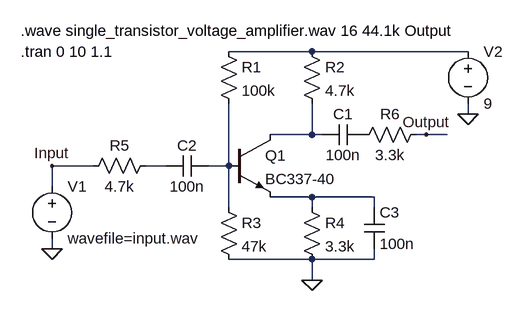
[diagram p0: schematic single_transistor_voltage_amplifier.asc]
single_transistor_voltage_amplifier.asc, the LTspice schematic file:
Version 4
SHEET 1 880 680
WIRE 224 -1696 96 -1696
WIRE 464 -1696 224 -1696
WIRE 464 -1600 464 -1616
WIRE 224 -1568 224 -1616
WIRE 224 -1568 160 -1568
WIRE 240 -1568 224 -1568
WIRE 400 -1568 384 -1568
WIRE 432 -1568 400 -1568
WIRE -112 -1520 -176 -1520
WIRE 0 -1520 -32 -1520
WIRE 96 -1520 96 -1616
WIRE 96 -1520 64 -1520
WIRE -176 -1488 -176 -1520
WIRE 224 -1472 160 -1472
WIRE 320 -1472 224 -1472
WIRE 96 -1456 96 -1520
WIRE 224 -1456 224 -1472
WIRE 320 -1456 320 -1472
WIRE -176 -1392 -176 -1408
WIRE 224 -1376 96 -1376
WIRE 320 -1376 320 -1392
WIRE 320 -1376 224 -1376
WIRE 224 -1344 224 -1376
FLAG -176 -1392 0
FLAG 224 -1344 0
FLAG 464 -1600 0
FLAG -176 -1520 Input
FLAG 400 -1568 Output
SYMBOL npn 96 -1568 R0
SYMATTR InstName Q1
SYMATTR Value BC337-40
SYMBOL res 80 -1712 R0
SYMATTR InstName R1
SYMATTR Value 100k
SYMBOL res 208 -1712 R0
SYMATTR InstName R2
SYMATTR Value 4.7k
SYMBOL res 80 -1472 R0
SYMATTR InstName R3
SYMATTR Value 47k
SYMBOL res 208 -1472 R0
SYMATTR InstName R4
SYMATTR Value 3.3k
SYMBOL res -16 -1536 R90
WINDOW 0 0 56 VBottom 2
WINDOW 3 32 56 VTop 2
SYMATTR InstName R5
SYMATTR Value 4.7k
SYMBOL res 400 -1584 R90
WINDOW 0 0 56 VBottom 2
WINDOW 3 32 56 VTop 2
SYMATTR InstName R6
SYMATTR Value 3.3k
SYMBOL cap 304 -1584 R90
WINDOW 0 0 32 VBottom 2
WINDOW 3 32 32 VTop 2
SYMATTR InstName C1
SYMATTR Value 100n
SYMBOL cap 64 -1536 R90
WINDOW 0 0 32 VBottom 2
WINDOW 3 32 32 VTop 2
SYMATTR InstName C2
SYMATTR Value 100n
SYMBOL cap 304 -1456 R0
SYMATTR InstName C3
SYMATTR Value 100n
SYMBOL voltage 464 -1712 R0
WINDOW 123 0 0 Left 0
WINDOW 39 0 0 Left 0
SYMATTR InstName V2
SYMATTR Value 9
SYMBOL voltage -176 -1504 R0
SYMATTR InstName V1
SYMATTR Value wavefile=input.wav
TEXT -224 -1728 Left 2 !.wave single_transistor_voltage_amplifier.wav 16 44.1k Output
TEXT -224 -1696 Left 2 !.tran 0 10 1.1

The netlist it stands for:
* single_transistor_voltage_amplifier.asc
Q1 N002 N004 N005 0 BC337-40
R1 N001 N004 100k
R2 N001 N002 4.7k
R3 N004 0 47k
R4 N005 0 3.3k
R5 N003 Input 4.7k
R6 Output P001 3.3k
C1 P001 N002 100n
C2 N004 N003 100n
C3 N005 0 100n
V2 N001 0 9
V1 Input 0 wavefile=input.wav
.model NPN NPN
.model PNP PNP
.lib standard.bjt
.wave single_transistor_voltage_amplifier.wav 16 44.1k Output
.tran 0 10 1.1
.backanno
.end